# Altium schematic sheet Power_V3.SchDoc
size A
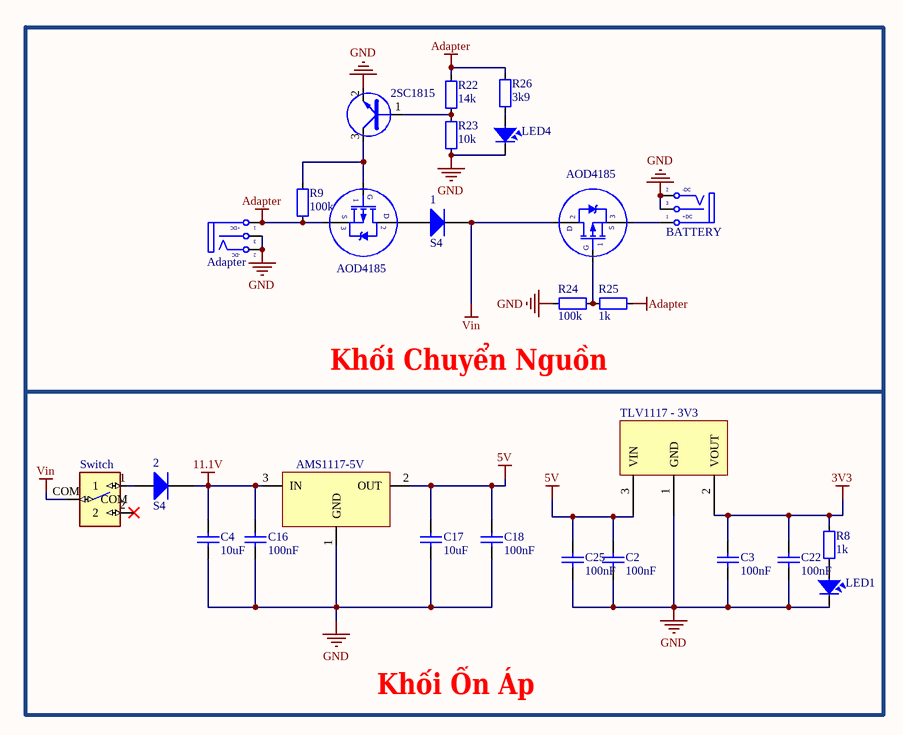
[diagram p0: Power_V3.SchDoc]

## Parts
1  S4  [DIO-214AC(SMA)]
2  S4  [DIO-214AC(SMA)]
C2  100nF  [CAP_0805]
C3  100nF  [CAP_0805]
C4  10uF  [CAP_0805]
C16  100nF  [CAP_0805]
C17  10uF  [CAP_0805]
C18  100nF  [CAP_0805]
C22  100nF  [CAP_0805]
C25  100nF  [CAP_0805]
IC2  AOD4185  [TO-252]
IC3  AOD4185  [TO-252]
JDC1  Adapter  [DC-IN]
JDC2  BATTERY  [DC-IN]
LED1  LED  [LED-0805-Blue]  (value not drawn)
LED4  LED  [LED-0805-Blue]  (value not drawn)
Power2  AMS1117-5V  [SOT223]
Q1  2SC1815  [SOT23D]
R8  1k  [RES-SMD-0805]
R9  100k  [RES-SMD-0805]
R22  14k  [RES-SMD-0805]
R23  10k  [RES-SMD-0805]
R24  100k  [RES-SMD-0805]
R25  1k  [RES-SMD-0805]
R26  3k9  [RES-SMD-0805]
Switch  SK12D07VG4  [SK12D07VG4]  (value not drawn)
TLV1117_-_3V3  LM1117- 5V  [SOT230P700X180-4N]  (value not drawn)

## Nets
3V3: C3.1 C22.1 R8.1 TLV1117_-_3V3.2(VOUT)
5V: C2.1 C17.1 C18.1 C25.1 Power2.2(OUT) TLV1117_-_3V3.3(VIN)
11.1V: 2.2(K) C4.1 C16.1 Power2.3(IN)
Adapter: IC2.3(S) JDC1.1(T) R9.1 R22.1 R25.1 R26.1
GND: C2.2 C3.2 C4.2 C16.2 C17.2 C18.2 C22.2 C25.2 JDC1.2(TN) JDC1.3(S) JDC2.2(TN) JDC2.3(S) LED1.2 LED4.2 Power2.1(GND) Q1.2(E) R23.2 R24.2 TLV1117_-_3V3.1(GND)
Vin: 1.2(K) IC3.2(D) Switch.COM
Net1_1: 1.1(A) IC2.2(D)
Net2_1: 2.1(A) Switch.1
NetIC2_1: IC2.1(G) Q1.3(C) R9.2
NetIC3_1: IC3.1(G) R24.1 R25.2
NetIC3_3: IC3.3(S) JDC2.1(T)
NetLED1_1: LED1.1 R8.2
NetLED4_1: LED4.1 R26.2
NetQ1_1: Q1.1(B) R22.2 R23.1

Not connected (* = marked no-connect by the designer): Switch 2*

## Notes on the sheet
- Khối Chuyển Nguồn
- Khối Ổn Áp
- (in symbol DCIN) +DC; -DC

## Library data of the parts
1 2 = Diode S4: Dán; Ten_Linh_Kien: Diode S4 SOD123 ( 1N5819 SOD123); Ma_Hang: MH005519; Don_Vi: Con; Ghi_Chu: *; Chung_Loai: Dán; Kieu_Chan: *
C2-C4 C16-C18 C22 C25 = CapSMD: Capacitor; Value: 33p; Published: 8-Jun-2000; LatestRevisionDate: 17-Jul-2002; LatestRevisionNote: Re-released for DXP Platform.; PackageReference: RAD-0.3; Publisher: Altium Limited
IC2 IC3 = MOSFET_P: Generic P Channel MOSFET
JDC1 JDC2 = DCIN: Jac DC input; Value: Jac DC
LED1 LED4 = LED: LED Single colour Green and Red; Value: LED 3 ly Single Colour
Power2 = LM1117: 800mA Low-Dropout Linear Regulator; Creator: Nguyen Ba Bien; Website: http://group3i.net
Q1 = C1815: NPN 600mW, ECB; Value: C1815
R8 R9 R22-R26 = Resistor - SMD: Resistor; Manufacturer: Generic Components; Class: Passive; Published: 08/06/2000; Publisher: Altium Hobart Technology Centre
Switch = SK12D07VG4: Switch Slide ON ON SPDT Side Slide 0.3A 30VDC PC Pins Bracket Mount/Through Hole Bulk; MF: C&K; Price: None; Check_prices: https://www.snapeda.com/parts/SK12D07VG4/C&K/view-part/6618061/?ref=eda; SnapEDA_Link: https://www.snapeda.com/parts/SK12D07VG4/C&K/view-part/6618061/?ref=snap; Package: None; Availability: Not in stock; MP: SK12D07VG4; Value: *
TLV1117_-_3V3 = LM1117